# EAGLE design Adafruit Trinket 5V microUSB (EAGLE 6.6.0)
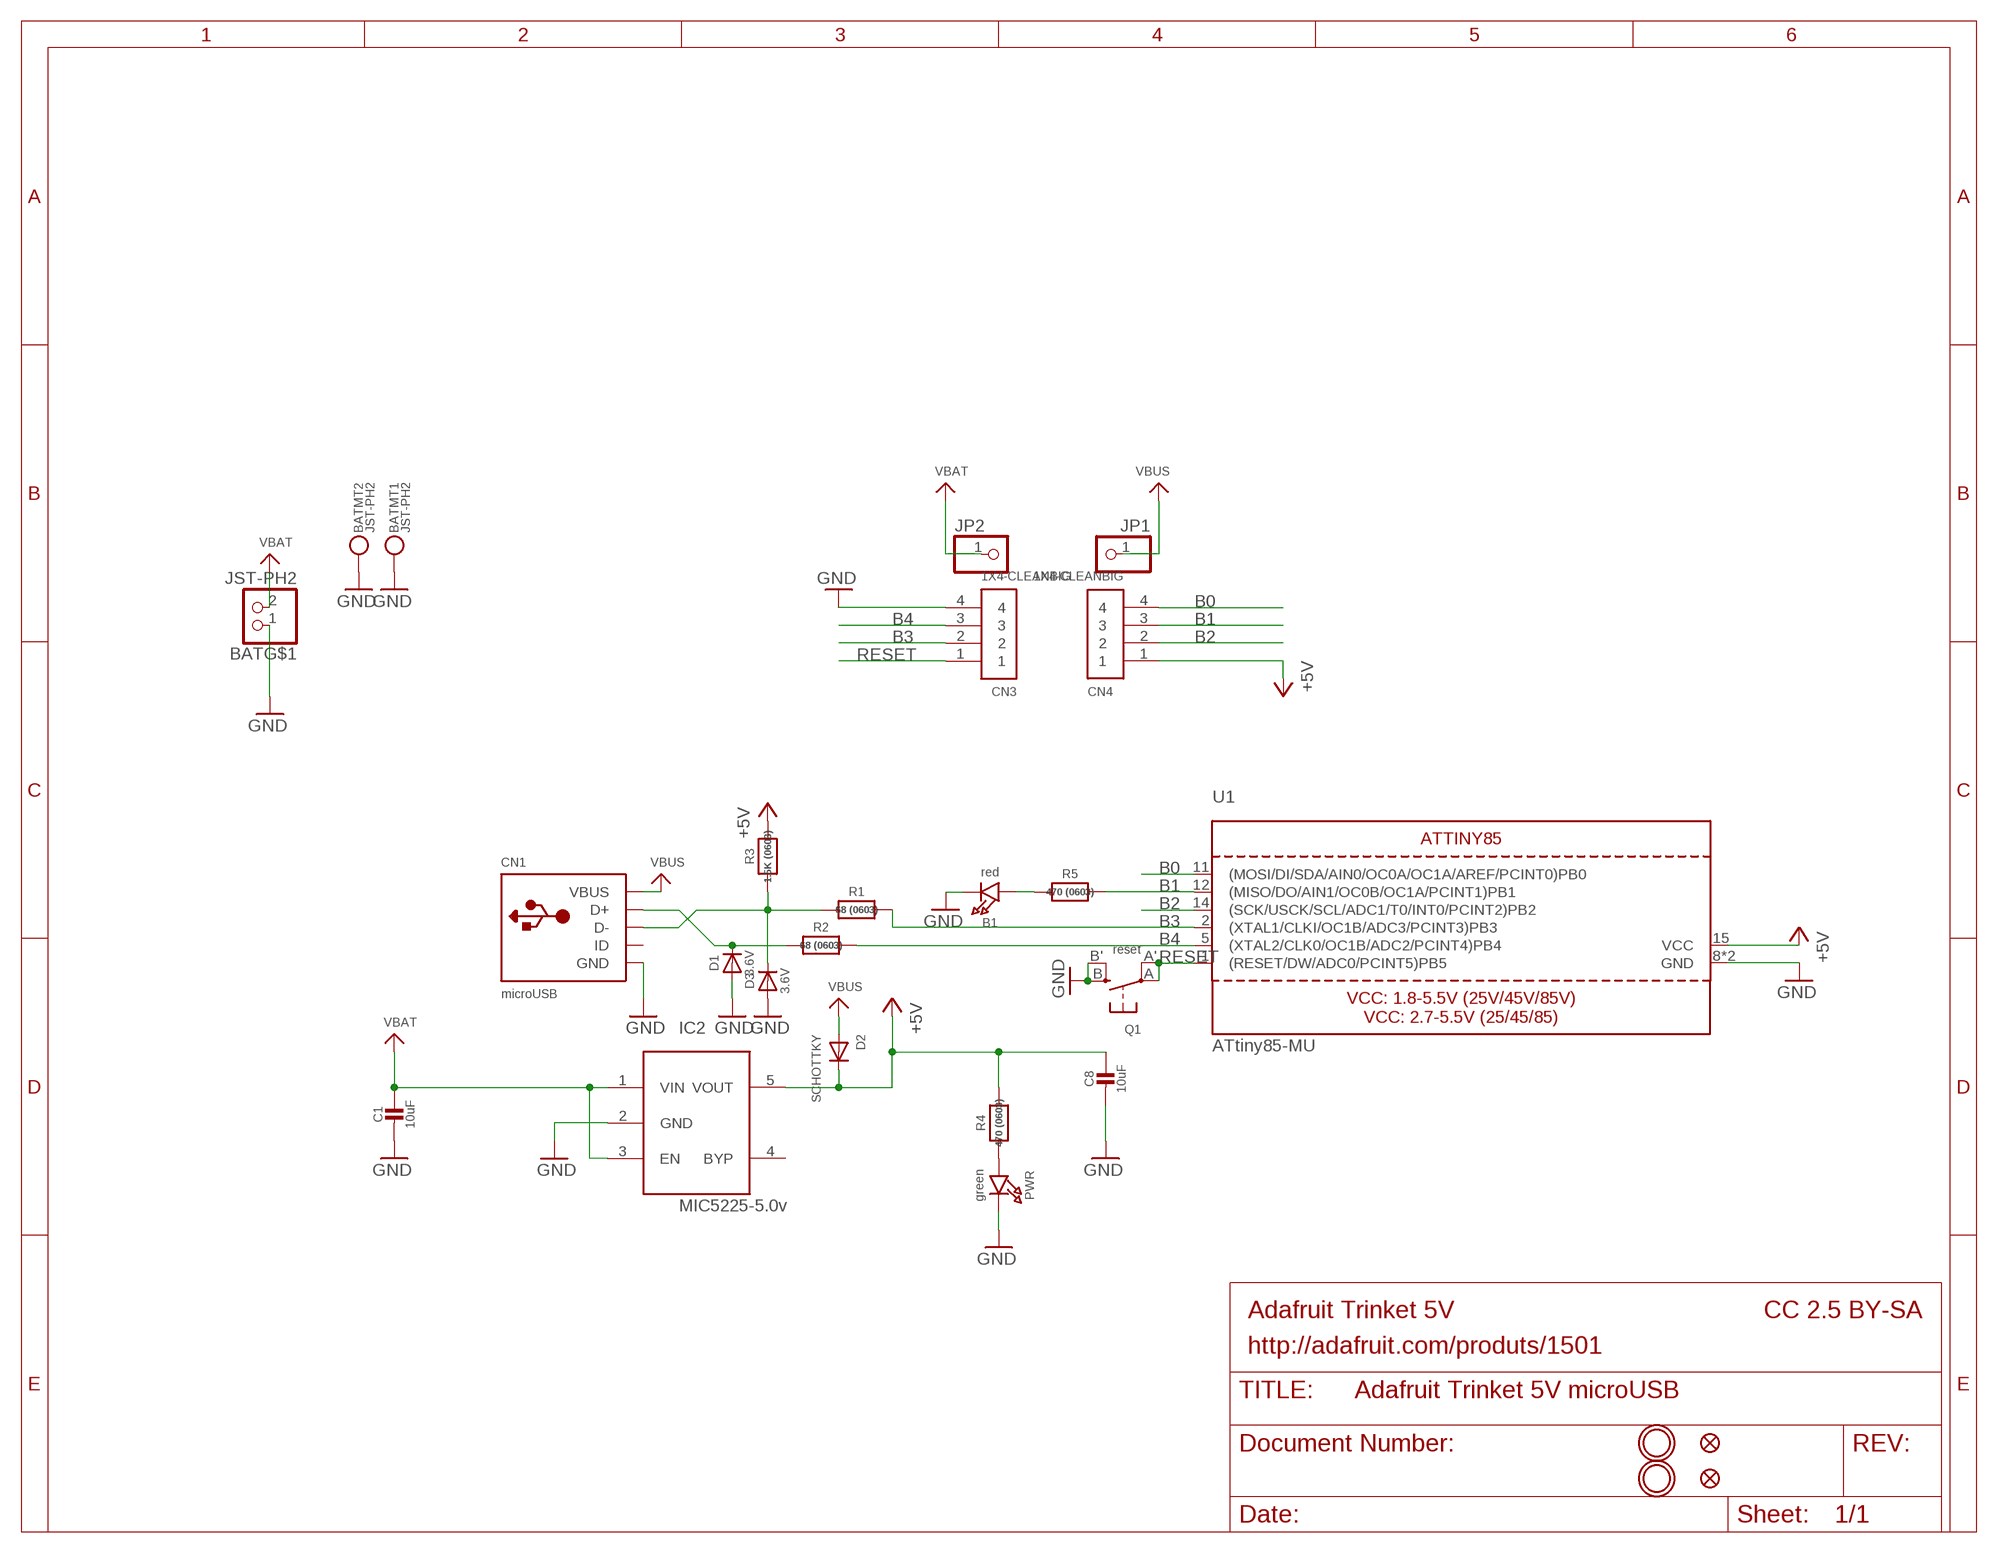
[diagram p0: schematic, sheet 1]

## Parts
B1  red  LED0805_NOOUTLINE  [CHIPLED_0805_NOOUTLINE]
BAT  JST-PH2  CON_JST_PH_2PIN_MTPH2  [JSTPH2]
C1  10uF  CAP_CERAMIC0805-NOOUTLINE  [0805-NO]
C8  10uF  CAP_CERAMIC0805-NOOUTLINE  [0805-NO]
CN1  microUSB  USBMICRO_20329  [4UCONN_20329]
CN3  1X4-CLEANBIG  [1X04-CLEANBIG]
CN4  1X4-CLEANBIG  [1X04-CLEANBIG]
D1  3.6V  DIODESOD-323  [SOD-323]
D2  SCHOTTKY  DIODE_SOD-123FL  [SOD-123FL]
D3  3.6V  DIODESOD-323  [SOD-323]
IC2  MIC5225-5.0v  LP298XS  [SOT23-5L]
JP1  PINHD-1X1CB  [1X01-CLEANBIG]
JP2  PINHD-1X1CB  [1X01-CLEANBIG]
PWR  green  LED0805_NOOUTLINE  [CHIPLED_0805_NOOUTLINE]
Q1  reset  SWITCH_TACT_SMT4.6X2.8  [BTN_KMR2_4.6X2.8]
R1  68 (0603)  RESISTOR_0603_NOOUT  [0603-NO]
R2  68 (0603)  RESISTOR_0603_NOOUT  [0603-NO]
R3  1.5K (0603)  RESISTOR_0603_NOOUT  [0603-NO]
R4  470 (0603)  RESISTOR_0603_NOOUT  [0603-NO]
R5  470 (0603)  RESISTOR_0603_NOOUT  [0603-NO]
U1  ATtiny85-MU  ATTINY85  [MLF20_4X4MM_0.5MM_ATMEL]
U$1  FIDUCIAL""  [FIDUCIAL_1MM]
U$6  FIDUCIAL""  [FIDUCIAL_1MM]
U$8  MOUNTINGHOLE2.0  [MOUNTINGHOLE_2.0_PLATED]
U$9  MOUNTINGHOLE2.0  [MOUNTINGHOLE_2.0_PLATED]

## Nets
+5V: C8.1 CN4.1 D2.C IC2.5(VOUT) R3.2 R4.2 U1.15(VCC)
B0: CN4.4 U1.11((MOSI/DI/SDA/AIN0/OC0A/OC1A/AREF/PCINT0)PB0)
B1: CN4.3 R5.2 U1.12((MISO/DO/AIN1/OC0B/OC1A/PCINT1)PB1)
B2: CN4.2 U1.14((SCK/USCK/SCL/ADC1/T0/INT0/PCINT2)PB2)
B3: CN3.2 R1.2 U1.2((XTAL1/CLKI/OC1B/ADC3/PCINT3)PB3)
B4: CN3.3 R2.2 U1.5((XTAL2/CLK0/OC1B/ADC2/PCINT4)PB4)
GND: B1.C BAT.1 BAT.NC1 BAT.NC2 C1.2 C8.2 CN1.BASE@1(GND) CN1.BASE@2(GND) CN1.GND CN1.SPRT@1(GND) CN1.SPRT@2(GND) CN1.SPRT@3(GND) CN1.SPRT@4(GND) CN3.4 D1.A D3.A IC2.2(GND) PWR.C Q1.B'(S1) Q1.B(S) U1.8(GND) U1.THERMAL(GND)
N$1: B1.A R5.1
N$2: CN1.D+ D1.C R2.1
N$5: CN1.D- D3.C R1.1 R3.1
N$6: PWR.A R4.1
RESET: CN3.1 Q1.A'(P1) Q1.A(P) U1.1((RESET/DW/ADC0/PCINT5)PB5)
VBAT: BAT.2 C1.1 IC2.1(VIN) IC2.3(EN) JP2.1
VBUS: CN1.VBUS D2.A JP1.1
Unconnected: CN1.ID IC2.4(BYP)

## Notes on the sheet
- Adafruit Trinket 5V | CC 2.5 BY-SA
- http://adafruit.com/produts/1501

## Library data of the parts
B1 PWR = microbuilder:LED: LED 0603 - 0603 Surface Mount Package 2mA: Green LED - Low Power (3.9mcd, 2ma, 1.7Vf) - Digikey: 475-2709-2-ND Orange LED - Low Power (9.8mcd, 2ma, 1.8Vf) - Digikey: 475-1194-2-ND Red LED - Low Power (5mcd, 2ma, 1.8Vf) - Digikey: 475-1195-2-ND Yellow LED - Low Power (7mcd, 2ma, 1.8Vf) - Digikey: 475-1196-2-ND 5mA: Blue LED - Low Power (17mcd, 5ma, 2.9Vf) - Digikey: LNJ937W8CRACT-ND 0805 - 0805 Surface Mount Package 2mA: Red LED (8.8mcd, 2mA, 1.8Vf, Clear) - Low Power [Digikey: 475-2510-1-ND] Green LED (5mcd, 2mA, 1.8Vf, Clear) - Low Power [Digikey: 475-2730-1-ND] Yellow LED (11.3mcd, 2mA, 1.8Vf, Clear) - Low Power [Digikey: 475-2555-1-ND] 20mA: Red LED (104mcd, 20mA, Diffused) - LS R976 [Digikey: 475-1278-6-ND] Red LED (12mcd, 20mA, 2.0Vf, Clear) - APT2012EC [Digikey: 754-1128-1-ND] Green LED (15mcd, 20mA, 2.2Vf, Clear) - APT2012GC [Digikey: 754-1131-1-ND] Orange LED (160mcd, 20mA, 2.1Vf, Clear) - APT2012SECK [Digikey: 754-1130-1-ND] 1206 - 1206 Surface Mount Package Green LED (26mcd, 20mA, Diffused) - LG N971 [Digikey: 475-1407-6-ND] Red LED (15mcd, 20mA, Diffused) - LH N974 [Digikey: 475-1416-6-ND] Cree - Cree High-Power Surface Mount LEDs XPEBWT-L1-0000-00D50 - White 111lm 350mA 2.9Vf 6200K 110° XTEAWT-00-0000-00000LEE3 - White 114lm 350mA 2.85Vf 5000K 115° Everlight - Everlight 45-21 Series Surface Mount LEDs 45-21/QK2C-B2832AC2CB2/2T - Warm White 2000mcd 20mA 3.25Vf 3050K 120° 45-21/LK2C-B38452C4CB2/2T - Nuetral White 2000mcd 20mA 3.25Vf 4150K 120° 45-21/LK2C-B50634C6CB2/2T - Cold White 2200mcd 20mA 3.25Vf 5650K 120° PLCC2 Reverse Mount LS T77K-J1L2-1-0-2-R18-Z - Red 11.25mcd 2mA 1.8Vf 630nm 120° LO T77K-L1M2-24-Z - Orange 19.6mcd 2mA 1.8Vf 606nm 120° LY T77K-K2M1-26-Z - Yellow 15.7mcd 2mA 1.8Vf 587nm 120°
BAT = microbuilder:CON_JST_PH_2PIN_MT
C1 C8 = microbuilder:CAP_CERAMIC: Ceramic Capacitors For new designs, use the packages preceded by an '_' character since they are more reliable: The following footprints should be used on most boards: _0402 - Standard footprint for regular board layouts _0603 - Standard footprint for regular board layouts _0805 - Standard footprint for regular board layouts _1206 - Standard footprint for regular board layouts For extremely tight-pitch boards where space is at a premium, the following 'micro-pitch' footprints can be used (smaller pads, no silkscreen outline, etc.): _0402MP - Micro-pitch footprint for very dense/compact boards _0603MP - Micro-pitch footprint for very dense/compact boards _0805MP - Micro-pitch footprint for very dense/compact boards _1206MP - Micro-pitch footprint for very dense/compact boards
CN1 = microbuilder:USB: USB Connectors USBMINIB - Surface Mount Female Mini-B USB Connector 4UConnector: 06564
CN3 CN4 = adafruit:1X4: 4-pin connector
D1 D3 = microbuilder:DIODE: Diode
D2 = adafruit:DIODE: Diode
IC2 = adafruit:LP298X
JP1 JP2 = adafruit:PINHD-1X1: Pin header 1x1 for 0.1" spacing With round pins
Q1 = microbuilder:SWITCH_TACT_SMT: SMT Tact Switches 6x6mm - Digikey: P12940SCT-ND KMR2 (4.6x2.8mm) - Digikey: 401-1426-1-ND EVQ-PQHB55 - Light Touch, 160GF (4.5x4.5mm) - Digikey: P8090SCT-ND KMT0 - KMT021 NGJ LHS (etc.) IP68/Waterproof - Digikey: CKN10289CT-ND
R1-R5 = microbuilder:RESISTOR: Resistors For new designs, use the packages preceded by an '_' character since they are more reliable: The following footprints should be used on most boards: _0402 - Standard footprint for regular board layouts _0603 - Standard footprint for regular board layouts _0805 - Standard footprint for regular board layouts _1206 - Standard footprint for regular board layouts For extremely tight-pitch boards where space is at a premium, the following 'micro-pitch' footprints can be used (smaller pads, no silkscreen outline, etc.): _0402MP - Micro-pitch footprint for very dense/compact boards _0603MP - Micro-pitch footprint for very dense/compact boards _0805MP - Micro-pitch footprint for very dense/compact boards _1206MP - Micro-pitch footprint for very dense/compact boards
U1 = microbuilder:ATTINY85: ATTINT85
U$1 U$6 = microbuilder:FIDUCIAL: Fiducial Alignment Points Various fiducial points for machine vision alignment.; BOM: EXCLUDE
U$8 U$9 = microbuilder:MOUNTINGHOLE: Mounting Hole For #2 screws (0.086"/2.18mm width, 0.094"/2.4mm hole) use 2.5mm; BOM: EXCLUDE

## Net classes
1 power: width 0.305 mm

## Board
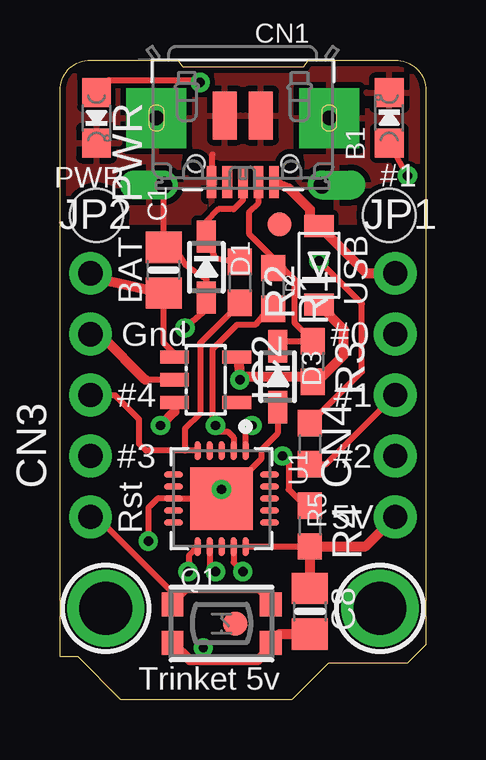
[diagram p1: board, top side]
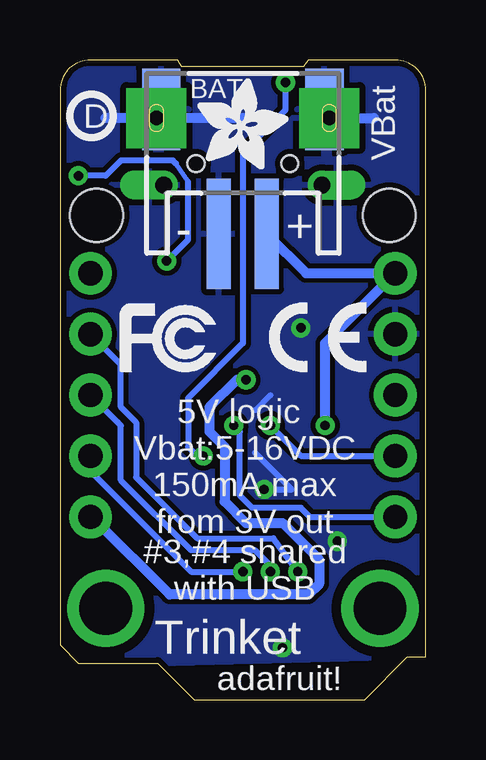
[diagram p2: board, bottom side, seen from below]

Size 15.24 x 26.67 mm. Coordinates in mm from the lower left corner, seen from the top.
Outline: 15.24,25.4 15.24,2.29 14.48,1.52 11.18,1.52 9.65,0 2.54,0 0.76,1.78 0,1.78 0,25.4 arc-90 1.27,26.67 4.9,26.67 5.11,26.39 10.16,26.39 10.34,26.67 13.97,26.67 arc-90 15.24,25.4
Copper layers (1*16): Top 0.035mm / dielectric 1.5mm / Bottom 0.035mm
Design rules "adafruit": minimum track width 8mil, minimum drill 15.5mil, track to track 8mil, track to pad 8mil, pad to pad 8mil, via to via 8mil, smd to smd 8mil, copper to edge 10mil, drill to drill 8mil, minimum pad ring 10mil, minimum via ring 8mil, stop-mask expansion 2mil, vias tented up to drill 20mil, thermal gap 10mil
Holes 2.2 mm at 1.52,20.19 13.72,20.19

### Footprints (pad centres in the part's own frame; a part is rotated, then mirrored left to right if it is on the bottom)
CHIPLED_0805_NOOUTLINE = smd 1.2 x 1.2: A 0,-1.05; C 0,1.05
JSTPH2 = smd 1 x 4.6: 1 -1,-3.7; 2 1,-3.7 | smd 1.6 x 3.4: NC1 -3.4,1.5; NC2 3.4,1.5
0805-NO = smd 1.3 x 1.5: 1 -0.95,0; 2 0.95,0
4UCONN_20329 = smd 1 x 2: BASE@1 -0.75,-2; BASE@2 0.75,-2 | smd 0.4 x 1.35: D+ 0,0.775; D- -0.65,0.775; GND 1.3,0.775; ID 0.65,0.775; VBUS -1.3,0.775 | drill 0.7 offset: SPRT@1 -3.3,0.9; SPRT@2 3.3,0.9 | drill 0.6 pad 2.5 square: SPRT@3 -3.6,-1.9; SPRT@4 3.6,-1.9 | hole 0.7: -1.95,0; 1.95,0
1X04-CLEANBIG = drill 1.016 pad 1.778: 1 -3.81,0; 2 -1.27,0; 3 1.27,0; 4 3.81,0
SOD-323 = smd 1.35 x 0.8: A 1.27,0; C -1.27,0
SOD-123FL = smd 0.91 x 1.22: A 1.637,0; C -1.637,0
SOT23-5L = smd 0.55 x 1.2: 1 -0.95,-1.3; 2 0,-1.3; 3 0.95,-1.3; 4 0.95,1.3; 5 -0.95,1.3
1X01-CLEANBIG = drill 1.016 pad 1.778: 1 0,0
BTN_KMR2_4.6X2.8 = smd 0.9 x 1: A 2.05,0.8; A' -2.05,0.8; B 2.05,-0.8; B' -2.05,-0.8
0603-NO = smd 1.1 x 1: 1 -0.85,0; 2 0.85,0
MLF20_4X4MM_0.5MM_ATMEL = smd 0.8 x 0.25: 1 -2,1; 2 -2,0.5; 3 -2,0; 4 -2,-0.5; 5 -2,-1; 11 2,-1; 12 2,-0.5; 13 2,0; 14 2,0.5; 15 2,1 | smd 0.25 x 0.8: 6 -1,-2; 7 -0.5,-2; 8 0,-2; 9 0.5,-2; 10 1,-2; 16 1,2; 17 0.5,2; 18 0,2; 19 -0.5,2; 20 -1,2 | smd 2.6 x 2.6: THERMAL 0,0
FIDUCIAL_1MM = smd 1 x 1: 1 0,0
MOUNTINGHOLE_2.0_PLATED = drill 2.2 pad 3: P$1 0,0

### Placement (x,y rotation side)
B1  13.72,24.26 0 top
BAT  7.62,23.11 0 bottom
C1  4.32,17.91 90 top
C8  10.41,3.68 270 top
CN1  7.62,22.35 180 top
CN3  1.27,11.43 90 top
CN4  13.97,11.43 90 top
D1  6.1,18.03 270 top
D2  10.79,18.11 90 top
D3  9.07,13.46 270 top
IC2  6.07,13.34 270 top
JP1  13.97,17.78 0 top
JP2  1.27,17.78 0 top
PWR  1.52,24.26 180 top
Q1  6.73,3.18 0 top
R1  8.89,17.14 270 top
R2  7.49,17.4 270 top
R3  10.54,14.1 270 top
R4  10.41,7.24 270 top
R5  10.41,10.67 270 top
U1  6.73,8.38 270 top
U$1  9.14,19.81 0 top
U$5  [ADAFRUIT_3.5MM]  9.53,22.1 0 bottom
U$6  7.3,3.18 0 top
U$8  1.91,3.81 0 top
U$9  13.34,3.81 0 top
U$12  [PCBFEAT-REV-040]  13.92,24.33 0 bottom
U$13  [SYMBOL_FCC_TINY]  12.74,13.67 0 bottom
U$14  [SYMBOL_CE_TINY]  6.52,13.67 0 bottom

### Tracks (layer width: path | path; a pad name or v marks a point on that pad's centre or on a via)
+5V  (via drill 0.39)
  Top 0.254: U1.15 R4.2 | 10.71,13.25 R3.2 | IC2.5 7.43,14.29
  Top 0.406: C8.1 R4.2 12.74,6.39 CN4.1 | D2.C 11.81,15.46 11.81,14.35 10.71,13.25 | 7.43,14.29 7.49,13.46 | 7.49,13.46 10.07,13.46 R3.2 | 7.49,13.46 v7.49,13.34
  Bottom 0.254: 13.78,7.49 CN4.1
  Bottom 0.406: v7.49,13.34 7.87,13.34 9.02,12.19 9.02,11.18 8.38,10.54 8.38,8.26 7.49,7.37 5.97,7.37 4.45,5.84 4.45,4.83 4.89,4.38 10.67,4.38 13.78,7.49
B0  (via drill 0.39)
  Top 0.254: U1.11 5.37,6 v5.33,5.33
  Bottom 0.254: v5.33,5.33 6.35,6.73 9.53,6.73 12.07,9.27 12.07,11.56 12.7,12.19 12.7,13.97 CN4.4
B1  (via drill 0.39)
  Top 0.254: U1.12 6.23,5.47 v6.48,5.33 | R5.2 11.09,9.82 CN4.3
  Bottom 0.254: v6.48,5.33 6.48,5.59 7.11,6.22 9.78,6.22 12.7,9.14 12.7,11.43 CN4.3 12.83,11.56
B2  (via drill 0.39)
  Top 0.254: U1.14 7.23,5.72 v7.62,5.33
  Bottom 0.254: CN4.2 13.97,9.4 13.84,9.4 9.78,5.33 v7.62,5.33
B3  (via drill 0.39)
  Top 0.254: v6.48,11.43 6.6,11.18 | 6.6,11.18 6.99,11.18 7.23,10.93 U1.2 | R1.2 8.89,16.51 8.13,15.62 7.37,15.62 6.35,14.61 6.35,11.43 6.6,11.18
  Bottom 0.254: v6.48,11.43 5.21,10.16 CN3.2
B4
  Top 0.254: CN3.3 2.29,12.7 3.3,11.68 3.3,10.67 3.59,10.38 5.21,10.38 | U1.5 5.21,10.38 | R2.2 7.49,16.51 5.84,14.86 5.84,11.94 5.21,11.3 5.21,10.38
GND  (via drill 0.39)
  Top 0.254: 8.78,2.18 Q1.B | D3.A 9.07,11.1 8.38,10.41 8.38,10.03 U1.THERMAL | CN1.SPRT@2 4.32,18.73 C1.2 4.89,18.67 5.21,18.16 6.1,17.53 D1.A 6.1,16.26 v5.21,15.49 | IC2.2 3.56,13.34 | v3.68,6.6 3.68,8 4.06,8.38 U1.8 U1.THERMAL | v6.73,8.76 U1.THERMAL | CN1.GND 6.35,21.61 6.35,22.73
  Top 0.406: Q1.B' 5.41,1.65 5.97,1.65 | 5.97,1.65 8.26,1.65 8.78,2.18 | Q1.B 9.14,2.73 C8.2 | 5.97,1.65 v5.97,2.16 | 3.56,13.34 1.78,15.11 1.4,15.11 CN3.4
  Bottom 0.254: v5.97,2.16 5.97,2.41 | v6.73,8.76 5.59,8.76 7.11,10.29 | 7.11,12.07 6.48,12.7 | v3.68,6.6 3.68,6.73
  Bottom 0.406: 2.16,24.26 2.16,24.25 CN1.SPRT@4 4.02,24.61 BAT.NC2 4.53,24.31 | CN1.SPRT@3 13.34,24.25 13.34,24.26 | BAT.NC1 11.22,24.61 CN1.SPRT@3 | CN1.SPRT@3 7.62,24.26
  pour Bottom: -0.25,26.8 0,1.78 15.24,1.4 14.99,26.42
  pour Top: 0.25,26.8 0.25,19.94 15.11,19.94 15.11,26.8
N$1  (via drill 0.39)
  Top 0.254: R5.1 12.57,13.68 12.57,16.51 v10.79,18.29 | v14.48,21.84 B1.A
  Bottom 0.203: 9.91,21.59 10.41,22.35
  Bottom 0.254: v10.79,18.29 9.91,19.18 9.91,21.59 | 10.41,22.35 10.54,22.48 12.7,22.48 13.34,21.84 v14.48,21.84
N$2
  Top 0.254: 7.49,18 R2.1 6.44,18.41 D1.C 6.1,19.94 6.6,20.45 7.24,20.45 7.62,20.83 CN1.D+
N$5
  Top 0.254: D3.C 9.11,14.95 R3.1 9.78,15.71 9.78,17.53 9.31,18 R1.1 8.89,18.41 7.87,19.43 7.87,20.32 8.26,20.7 8.26,21.56 CN1.D-
N$6  (via drill 0.39)
  Top 0.254: PWR.A 2.05,25.83 5.59,25.83 5.84,25.65 v5.84,25.73 | v9.27,10.16 9.53,9.91 9.53,8.76 10.2,8.09 R4.1
  Bottom 0.254: v9.27,10.16 9.4,10.03 9.91,10.54 9.91,12.57 7.62,14.86 7.62,22.81 5.84,24.59 v5.84,25.73
RESET  (via drill 0.39)
  Top 0.254: Q1.A 8.78,4.05 8.26,4.57 5.28,4.57 Q1.A' 4.68,4.46 1.52,7.62 CN3.1 | U1.1 7.75,11.16 v8,11.43
  Bottom 0.254: CN3.1 4.83,7.62 5.21,8 7.24,8 7.75,8.51 7.75,11.18 v8,11.43
VBAT  (via drill 0.39)
  Top 0.254: IC2.1 4.84,14.35 4.32,14.87 C1.1
  Top 0.406: JP2.1 1.97,17.46 C1.1 | IC2.3 4.77,12.01 v4.19,11.43
  Bottom 0.406: BAT.2 4.99,17.78 JP2.1 4.19,14.86 v4.19,11.43
VBUS
  Top 0.254: 10.41,20.13 D2.A
  Top 0.406: D2.A 12.76,17.78 JP1.1 | CN1.VBUS 9.54,21.32 10.41,20.45 10.41,20.13

### Text on the board
tPlace: PWR | #1 | BAT | USB | Gnd | #0 | #4 | #1 | #3 | #2 | Rst | 5V | Trinket 5v
bPlace: VBat | + | - | 5V logic | Vbat:5-16VDC / 150mA max / from 3V out | #3,#4 shared / with USB | Trinket | adafruit!